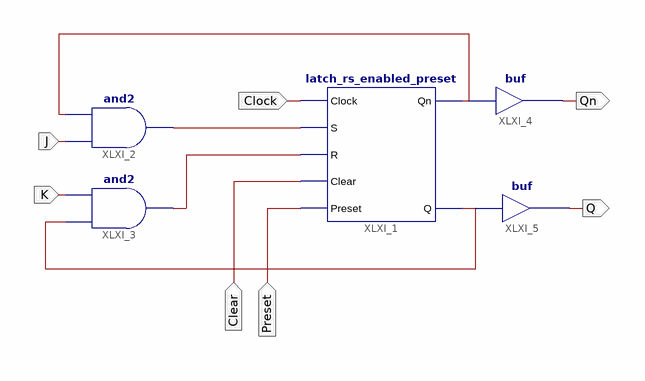
[diagram p0: schematic sheet 1]
// Xilinx ISE schematic FF_JK_Preset.sch (spartan3e) as structural Verilog: 5 symbols, 7 ports
module FF_JK_Preset (
  input  Clear,
  input  Preset,
  input  J,
  input  K,
  input  Clock,
  output Qn,
  output Q
);

  wire XLXN_1, XLXN_2, XLXN_12, XLXN_13;

  latch_rs_enabled_preset XLXI_1 (
    .Clock(Clock), .S(XLXN_1), .R(XLXN_2), .Clear(Clear), .Preset(Preset), .Qn(XLXN_12), .Q(XLXN_13));
  and XLXI_2 (XLXN_1, J, XLXN_12);
  and XLXI_3 (XLXN_2, XLXN_13, K);
  buf XLXI_4 (Qn, XLXN_12);
  buf XLXI_5 (Q, XLXN_13);
endmodule
